# Altium schematic sheet KeyFob.SchDoc
size A3; Organization: Altium Limited; Address1: L3, 12a Rodborough Rd; Address2: Frenchs Forest; Address3: NSW; Address4: Australia 2086; SheetNumber: 1; SheetTotal: 1
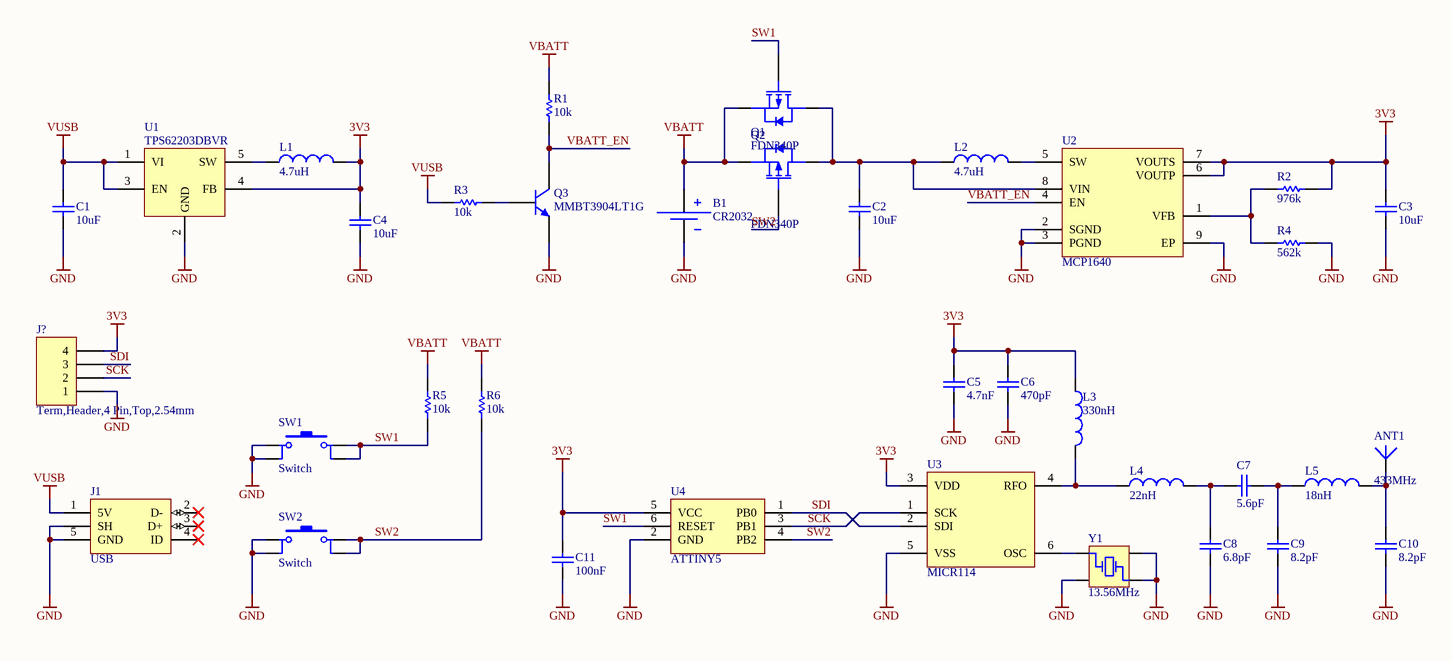
[diagram p0: KeyFob.SchDoc]

## Parts
ANT1  433MHz  [Ant,Chip,SMD]
B1  CR2032  [Holder,Cell,CR2032,PCB,SMD]
C1  10uF  [Cap,SMD,0805]
C2  10uF  [Cap,SMD,0805]
C3  10uF  [Cap,SMD,0805]
C4  10uF  [Cap,SMD,0805]
C5  4.7nF  [Cap,SMD,0603]
C6  470pF  [Cap,SMD,0603]
C7  5.6pF  [Cap,SMD,0402]
C8  6.8pF  [Cap,SMD,0402]
C9  8.2pF  [Cap,SMD,0402]
C10  8.2pF  [Cap,SMD,0402]
C11  100nF  [Cap,SMD,0603]
J1  USB  [Conn,USB,MicroB,SMD]
J?  Term,Header,4 Pin,Top,2.54mm  [Term,Header,4Pin,2.54mm]
L1  4.7uH  [IND,0805]
L2  4.7uH  [IND,0805]
L3  330nH  [ind,0402]
L4  22nH  [ind,0402]
L5  18nH  [ind,0402]
Q1  FDN340P  [SOT23-3]
Q2  FDN340P  [SOT23-3]
Q3  MMBT3904LT1G  [SOT23-3]
R1  10k  [RES,0603]
R2  976k  [RES,0603]
R3  10k  [RES,0603]
R4  562k  [RES,0603]
R5  10k  [RES,0603]
R6  10k  [RES,0603]
SW1  Switch  [Switch,Tactile,SPST-NO,SMD]
SW2  Switch  [Switch,Tactile,SPST-NO,SMD]
U1  TPS62203DBVR  [SOT23-5]
U2  MCP1640  [IC,DFN,2x3mm,P0.5,SMD]
U3  MICR114  [SOT23-6]
U4  ATTINY5  [SOT23-6]
Y1  13.56MHz  [XTAL,SMD,4 Pin]

## Nets
3V3: C3.2 C4.2 C5.2 C6.2 C11.2 J?.4 L1.2 L3.1 R2.1 U1.4(FB) U2.6(VOUTP) U2.7(VOUTS) U3.3(VDD) U4.5(VCC)
GND: B1.2(BATT_N) C1.1 C2.1 C3.1 C4.1 C5.1 C6.1 C8.1 C9.1 C10.1 C11.1 J1.0(SH) J1.5(GND) J?.1 Q3.2(E) R4.1 SW1.1 SW1.2 SW2.1 SW2.2 U1.2(GND) U2.2(SGND) U2.3(PGND) U2.9(EP) U3.5(VSS) U4.2(GND) Y1.2(GND) Y1.3(OSC2) Y1.4(GND)
VBATT: B1.1(BATT_P) Q1.2(S) Q2.2(S) R1.2 R5.1 R6.1
VUSB: C1.2 J1.1(5V) R3.1 U1.1(VI) U1.3(EN)
SCK: J?.2 U3.1(SCK) U4.3(PB1)
SDI: J?.3 U3.2(SDI) U4.1(PB0)
SW1: Q1.1(G) R5.2 SW1.3 SW1.4 U4.6(RESET)
SW2: Q2.1(G) R6.2 SW2.3 SW2.4 U4.4(PB2)
VBATT_EN: Q3.3(C) R1.1 U2.4(EN)
NetANT1_1: ANT1.1(ANT) C10.2 L5.2
NetC2_2: C2.2 L2.1 Q1.3(D) Q2.3(D) U2.8(VIN)
NetC7_1: C7.1 C9.2 L5.1
NetC7_2: C7.2 C8.2 L4.2
NetL1_1: L1.1 U1.5(SW)
NetL2_2: L2.2 U2.5(SW)
NetL3_2: L3.2 L4.1 U3.4(RFO)
NetQ3_1: Q3.1(B) R3.2
NetR2_2: R2.2 R4.2 U2.1(VFB)
NetU3_6: U3.6(OSC) Y1.1(OSC1)

Not connected (* = marked no-connect by the designer): J1 2(D-)* 3(D+)* 4(ID)*

## Notes on the sheet
- Title
- Size:
- Date:
- A3
- Revision:
- Sheet
- of
- Design By:

## Library data of the parts
ANT1 = Ant,433MHz,Chip,SMD: 433MHz - Chip RF Antenna 419MHz ~ 447MHz 0.79dBi Solder Surface Mount; Manufacturer: Yageo; Manufacturer Part Number: ANT1204F002R0433A; Vendor Part Number: 311-1570-1-ND; Vendor: Digikey; HelpURL: https://www.yageo.com/upload/media/product/productsearch/datasheet/wireless/An_SMD_UHF_433_1204_0.pdf; CreatedBy: Judd Foster
B1 = Holder,Cell,CR2032,PCB,SMD: Battery Retainer Coin, 20.0mm 1 Cell SMD (SMT) Tab; Manufacturer: Keystone Electronics; Manufacturer Part Number: 3034; Vendor Part Number: 36-3034-ND; Vendor: Digikey; CreatedBy: Judd Foster; HelpURL: https://www.keyelco.com/userAssets/file/M65p9.pdf
C1-C4 = CAP,Cer,10uF,10VDC,X5R,0805: CAP CER 10UF 10V X5R 0805; Vendor Part Number: 399-4925-1-ND; Manufacturer: KEMET; Manufacturer Part Number: C0805C106K8PACTU; Vendor: Digikey; HelpURL: https://content.kemet.com/datasheets/KEM_C1006_X5R_SMD.pdf; CreatedBy: Judd Foster
C5 = CAP,Cer,4.7nF,50VDC,X7R,0603: CAP CER 4700PF 50V X7R 0603; Vendor Part Number: 399-1087-1-ND; Manufacturer: KEMET; Manufacturer Part Number: C0603C472K5RACTU; Vendor: Digikey; HelpURL: https://content.kemet.com/datasheets/KEM_C1002_X7R_SMD.pdf; CreatedBy: Judd Foster
C6 = CAP,Cer,470pF,100VDC,X7R,0603: 470 pF ±10% 100V Ceramic Capacitor X7R 0603 (1608 Metric); Vendor Part Number: 478-9373-1-ND; Manufacturer: AVX Corporation; Manufacturer Part Number: 06031C471K4T2A; Vendor: Digikey; HelpURL: https://datasheets.avx.com/AutoMLCC.pdf; CreatedBy: Judd Foster
C7 = CAP,Cer,5.6pF,50VDC,C0G/NP0,0402: 5.6 pF ±0.1pF 50V Ceramic Capacitor C0G, NP0 0402 (1005 Metric); Vendor Part Number: 478-11363-1-ND; Manufacturer: AVX Corporation; Manufacturer Part Number: 04025A5R6BAT2A; Vendor: Digikey; HelpURL: https://datasheets.avx.com/C0GNP0-Dielectric.pdf; CreatedBy: Judd Foster
C8 = CAP,Cer,6.8pF,50VDC,C0G/NP0,0402: ±0.05pF 50V Ceramic Capacitor C0G, NP0 0402 (1005 Metric); Vendor Part Number: 490-14447-1-ND; Manufacturer: Murata Electronics; Manufacturer Part Number: GJM1555C1H6R8WB01D; Vendor: Digikey; HelpURL: https://search.murata.co.jp/Ceramy/image/img/A01X/G101/ENG/GJM1555C1H6R8WB01-01.pdf; CreatedBy: Judd Foster
C9 C10 = CAP,Cer,8.2pF,50VDC,C0G/NP0,0402_1: 8.2 pF ±0.05pF 50V Ceramic Capacitor C0G, NP0 0402 (1005 Metric); Vendor Part Number: 490-11241-1-ND; Manufacturer: Murata Electronics; Manufacturer Part Number: GJM1555C1H8R2WB01D; Vendor: Digikey; HelpURL: https://search.murata.co.jp/Ceramy/image/img/A01X/G101/ENG/GJM1555C1H8R2WB01-01.pdf; CreatedBy: Judd Foster
C11 = CAP,Cer,100nF,25VDC,Y5V,0603: CAP CER 0.1UF 25V Y5V 0603; Vendor Part Number: 399-1100-1-ND; Manufacturer: KEMET; Manufacturer Part Number: C0603C104Z3VACTU; Vendor: Digikey; HelpURL: https://content.kemet.com/datasheets/KEM_C1005_Y5V_SMD.pdf; CreatedBy: Judd Foster
J1 = Conn,USB.Micro_B,SMD: USB - micro B USB 2.0 Receptacle Connector 5 Position Surface Mount, Right Angle; Through Hole; Manufacturer: Amphenol ICC (FCI); Manufacturer Part Number: 10118193-0001LF; Vendor Part Number: 609-4616-1-ND; Vendor: Digikey; CreatedBy: Judd Foster; HelpURL: https://cdn.amphenol-icc.com/media/wysiwyg/files/documentation/datasheet/inputoutput/io_usb_micro.pdf
J? = Term,Header,4 Pin,Top,2.54mm: Connector Header Through Hole 4 position 0.100" (2.54mm); Vendor Part Number: 609-10082627-404HLF-ND; Manufacturer: Amphenol ICC (FCI); Manufacturer Part Number: 10082627-404HLF; Vendor: Digikey; HelpURL: https://cdn.amphenol-icc.com/media/wysiwyg/files/drawing/10082627.pdf; Created By: Judd Foster
L1 L2 = IND,4.7uH,80mA,Multilayer,0805: 4.7 µH Shielded Multilayer Inductor 80 mA 300mOhm 0805 (2012 Metric); Vendor Part Number: 445-3169-1-ND; Manufacturer: TDK Corporation; Manufacturer Part Number: MLZ2012E4R7MT000; Vendor: Digikey; HelpURL: https://product.tdk.com/en/system/files?file=dam/doc/product/inductor/inductor/smd/catalog/inductor_commercial_decoupling_mlz2012_en.pdf; CreatedBy: Judd Foster
L3 = IND,330nH,300mA,Multilayer,0402: 330 nH Shielded Multilayer Inductor 300 mA 600mOhm Max 0402 (1005 Metric); Vendor Part Number: 490-17863-1-ND; Manufacturer: Murata Electronics; Manufacturer Part Number: LQB15NNR33M10D; Vendor: Digikey; HelpURL: https://search.murata.co.jp/Ceramy/image/img/P02/JELF243B-0045.pdf; CreatedBy: Judd Foster
L4 = IND,22nH,800mA,Wirewound,0402: 22 nH Unshielded Wirewound Inductor 800 mA 160mOhm 0402 (1005 Metric) -; Vendor Part Number: 2035-1087-1-ND; Manufacturer: Delta Electronics/Components; Manufacturer Part Number: 0402HP-220EGTS; Vendor: Digikey; HelpURL: https://www.deltaww.com/filecenter/Products/download/04/0402/0402HP.pdf; CreatedBy: Judd Foster
L5 = IND,18nH,370mA,Wirewound,0402: 18 nH Unshielded Wirewound Inductor 370 mA 270mOhm 0402 (1005 Metric) -; Vendor Part Number: 2035-1047-1-ND; Manufacturer: Delta Electronics/Components; Manufacturer Part Number: 0402HM-180EGTS; Vendor: Digikey; HelpURL: https://filecenter.deltaww.com/Products/download/04/0402/0402HM.pdf; CreatedBy: Judd Foster
Q1 Q2 = MOSFET,P Ch,20V,2A: P-Channel 20V 2A (Ta) 500mW (Ta) Surface Mount SuperSOT-3; Manufacturer: ON Semiconductor; Vendor Part Number: FDN340PCT-ND; Vendor: Digikey; CreatedBy: Judd Foster; HelpURL: https://www.onsemi.com/pub/Collateral/FDN340P-D.PDF; Manufacturer Part Number: FDN340P
Q3 = Trans,NPN,40V,200mA,SMD: TRANS NPN 40V 0.2A SOT23; Manufacturer: ON Semiconductor; Vendor Part Number: MMBT3904LT1GOSCT-ND; Vendor: Digikey; CreatedBy: Judd Foster; HelpURL: https://www.onsemi.com/pub/Collateral/MMBT3904LT1-D.PDF; Manufacturer Part Number: MMBT3904LT1G
R1 R3 R5 R6 = RES,10k,1%,0.1W,0603: RES SMD 10K OHM 1% 1/10W 0603; Manufacturer: Yageo; Manufacturer Part Number: RC0603FR-0710KL; Vendor Part Number: 311-10.0KHRCT-ND; Vendor: Digikey; CreatedBy: Judd Foster; HelpURL: https://www.yageo.com/upload/media/product/productsearch/datasheet/rchip/PYu-RC_Group_51_RoHS_L_10.pdf
R2 = RES,976k,1%,0.1W,0603: 976 kOhms ±1% 0.1W, 1/10W Chip Resistor 0603 (1608 Metric) Automotive AEC-Q200 Thick Film; Manufacturer: Stackpole Electronics Inc; Manufacturer Part Number: RMCF0603FT976K; Vendor Part Number: RMCF0603FT976KCT-ND; Vendor: Digikey; CreatedBy: Judd Foster; HelpURL: https://www.seielect.com/catalog/sei-rmcf_rmcp.pdf
R4 = RES,562k,1%,0.1W,0603: 562 kOhms ±1% 0.1W, 1/10W Chip Resistor 0603 (1608 Metric) Automotive AEC-Q200 Thick Film; Manufacturer: Stackpole Electronics Inc; Manufacturer Part Number: RMCF0603FT562K; Vendor Part Number: RMCF0603FT562KCT-ND; Vendor: Digikey; CreatedBy: Judd Foster; HelpURL: https://www.seielect.com/catalog/sei-rmcf_rmcp.pdf
SW1 SW2 = Switch,Tactile,SPST-NO,SMD,H5.0: Tactile Switch SPST-NO Top Actuated Surface Mount; Manufacturer: C&K; Manufacturer Part Number: PTS645SK50SMTR92 LFS; Vendor Part Number: CKN9087CT-ND; Vendor: Digikey; CreatedBy: Judd Foster; HelpURL: https://dznh3ojzb2azq.cloudfront.net/products/Tactile/PTS645/documents/datasheet.pdf
U1 = TPS62203DBVR: IC REG BUCK 3.3V 300MA SOT23-5; Manufacturer: Texas Instruments; Vendor Part Number: 296-39452-1-ND; Vendor: Digikey; CreatedBy: Judd Foster; HelpURL: http://www.ti.com/lit/ds/symlink/tps62203.pdf; Manufacturer Part Number: TPS62203DBVR
U2 = MCP1640CT-I/MC: AVR series Microcontroller IC 8-Bit 12MHz 512B (256 x 16) FLASH SOT-23-6; Manufacturer: Microchip Technology; Vendor Part Number: MCP1640CT-I/MCCT-ND; Vendor: Digikey; CreatedBy: Judd Foster; HelpURL: https://ww1.microchip.com/downloads/en/DeviceDoc/20002234D.pdf; Manufacturer Part Number: MCP1640CT-I/MC
U3 = MICRF114T-I/OT: RF Transmitter - 285MHz ~ 445MHz 13dBm 115.2kbps - Antenna SOT-23-6; Manufacturer: Microchip; Vendor Part Number: MICRF114T-I/OTCT-ND; Vendor: Digikey; CreatedBy: Judd Foster; HelpURL: https://ww1.microchip.com/downloads/en/DeviceDoc/50002416A.pdf; Manufacturer Part Number: MICRF114T-I/OT
U4 = ATTINY5-TSHR: AVR series Microcontroller IC 8-Bit 12MHz 512B (256 x 16) FLASH SOT-23-6; Manufacturer: Microchip Technology; Vendor Part Number: ATTINY5-TSHRCT-ND; Vendor: Digikey; CreatedBy: Judd Foster; HelpURL: https://ww1.microchip.com/downloads/en/DeviceDoc/Atmel-8127-AVR-8-bit-Microcontroller-ATtiny4-ATtiny5-ATtiny9-ATtiny10_Datasheet-Summary.pdf; Manufacturer Part Number: ATTINY5-TSHR
Y1 = XTAL,13.56MHz,18pF,SMD: ±20ppm Crystal 18pF 4-SMD, No Lead; Manufacturer Part Number: NX3225SA-13.56M-STD-CSR-3; Manufacturer: NDK America, Inc.; Vendor Part Number: 644-1235-1-ND; Vendor: Digikey; CreatedBy: Judd Foster; HelpURL: https://media.digikey.com/pdf/Data%20Sheets/NDK%20PDFs/NX3225SA_STD-CSR-3.pdf